# EAGLE design display3 (EAGLE 5.00)
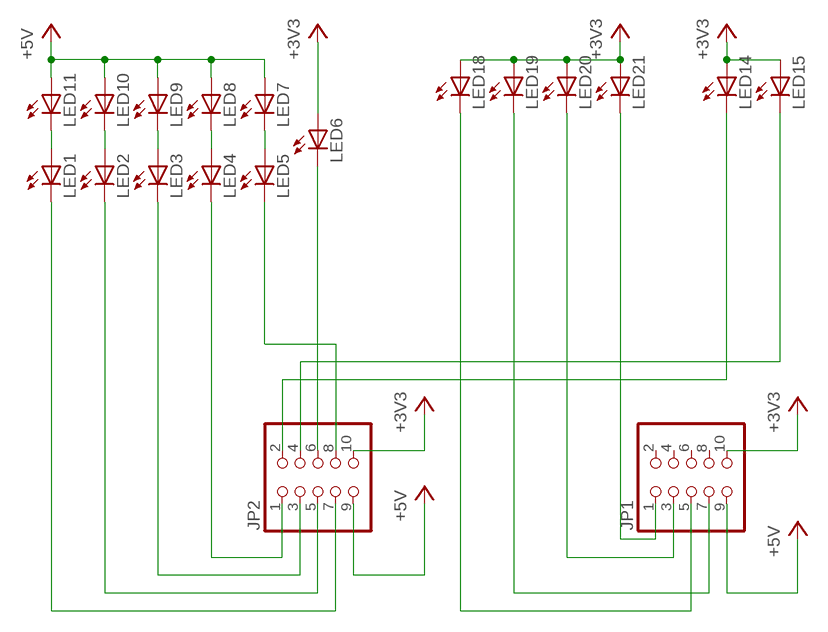
[diagram p0: schematic, sheet 1]

## Parts
JP1  PINHD-2X5  [2X05]
JP2  PINHD-2X5  [2X05]
LED1  LED5MM  [LED5MM]
LED2  LED5MM  [LED5MM]
LED3  LED5MM  [LED5MM]
LED4  LED5MM  [LED5MM]
LED5  LED5MM  [LED5MM]
LED6  LED5MM  [LED5MM]
LED7  LED5MM  [LED5MM]
LED8  LED5MM  [LED5MM]
LED9  LED5MM  [LED5MM]
LED10  LED5MM  [LED5MM]
LED11  LED5MM  [LED5MM]
LED14  LED5MM  [LED5MM]
LED15  LED5MM  [LED5MM]
LED18  LED5MM  [LED5MM]
LED19  LED5MM  [LED5MM]
LED20  LED5MM  [LED5MM]
LED21  LED5MM  [LED5MM]

## Nets
+3V3: JP1.10 JP2.10 LED6.A LED14.A LED15.A LED18.A LED19.A LED20.A LED21.A
+5V: JP1.9 JP2.9 LED7.A LED8.A LED9.A LED10.A LED11.A
N$1: JP2.7 LED1.K(C)
N$2: JP2.5 LED2.K(C)
N$3: JP2.3 LED3.K(C)
N$4: JP2.1 LED4.K(C)
N$5: JP2.8 LED5.K(C)
N$6: JP2.6 LED6.K(C)
N$7: JP1.5 LED18.K(C)
N$8: JP1.7 LED19.K(C)
N$9: JP1.3 LED20.K(C)
N$10: JP2.2 LED14.K(C)
N$14: JP1.1 LED21.K(C)
N$16: LED1.A LED11.K(C)
N$17: LED2.A LED10.K(C)
N$18: LED3.A LED9.K(C)
N$19: LED4.A LED8.K(C)
N$20: LED5.A LED7.K(C)
N$25: JP2.4 LED15.K(C)
Unconnected: JP1.2 JP1.4 JP1.6 JP1.8

## Library data of the parts
JP1 JP2 = pinhead:PINHD-2X5: PIN HEADER
LED1-LED11 LED14 LED15 LED18-LED21 = led:LED: LED OSRAM: - CHIPLED LG R971, LG N971, LY N971, LG Q971, LY Q971, LO R971, LY R971 LH N974, LH R974 LS Q976, LO Q976, LY Q976 LO Q996 - Hyper CHIPLED LW Q18S LB Q993, LB Q99A, LB R99A - SideLED LS A670, LO A670, LY A670, LG A670, LP A670 LB A673, LV A673, LT A673, LW A673 LH A674 LY A675 LS A676, LA A676, LO A676, LY A676, LW A676 LS A679, LY A679, LG A679 - Hyper Micro SIDELED® LS Y876, LA Y876, LO Y876, LY Y876 LT Y87S - SmartLED LW L88C, LW L88S LB L89C, LB L89S, LG L890 LS L89K, LO L89K, LY L89K LS L896, LA L896, LO L896, LY L896 - TOPLED LS T670, LO T670, LY T670, LG T670, LP T670 LSG T670, LSP T670, LSY T670, LOP T670, LYG T670 LG T671, LOG T671, LSG T671 LB T673, LV T673, LT T673, LW T673 LH T674 LS T676, LA T676, LO T676, LY T676, LB T676, LH T676, LSB T676, LW T676 LB T67C, LV T67C, LT T67C, LS T67K, LO T67K, LY T67K, LW E67C LS E67B, LA E67B, LO E67B, LY E67B, LB E67C, LV E67C, LT E67C LW T67C LS T679, LY T679, LG T679 LS T770, LO T770, LY T770, LG T770, LP T770 LB T773, LV T773, LT T773, LW T773 LH T774 LS E675, LA E675, LY E675, LS T675 LS T776, LA T776, LO T776, LY T776, LB T776 LHGB T686 LT T68C, LB T68C - Hyper Mini TOPLED® LB M676 - Mini TOPLED Santana® LG M470 LS M47K, LO M47K, LY M47K Source: http://www.osram.convergy.de - LUMILED® LXK2-PW12-R00, LXK2-PW12-S00, LXK2-PW14-U00, LXK2-PW14-V00 LXK2-PM12-R00, LXK2-PM12-S00, LXK2-PM14-U00 LXK2-PE12-Q00, LXK2-PE12-R00, LXK2-PE12-S00, LXK2-PE14-T00, LXK2-PE14-U00 LXK2-PB12-K00, LXK2-PB12-L00, LXK2-PB12-M00, LXK2-PB14-N00, LXK2-PB14-P00, LXK2-PB14-Q00 LXK2-PR12-L00, LXK2-PR12-M00, LXK2-PR14-Q00, LXK2-PR14-R00 LXK2-PD12-Q00, LXK2-PD12-R00, LXK2-PD12-S00 LXK2-PH12-R00, LXK2-PH12-S00 LXK2-PL12-P00, LXK2-PL12-Q00, LXK2-PL12-R00 Source: www.luxeon.com

## Board
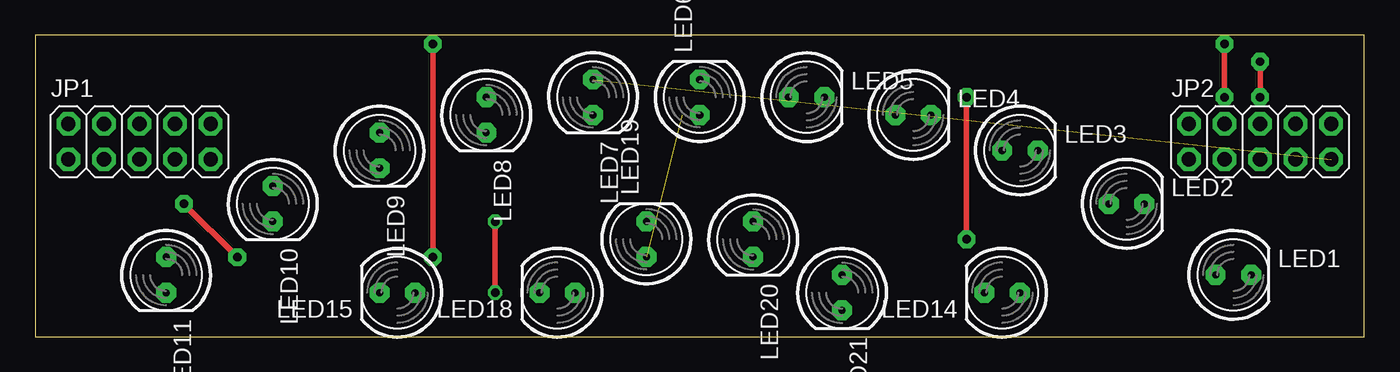
[diagram p1: board, top side]
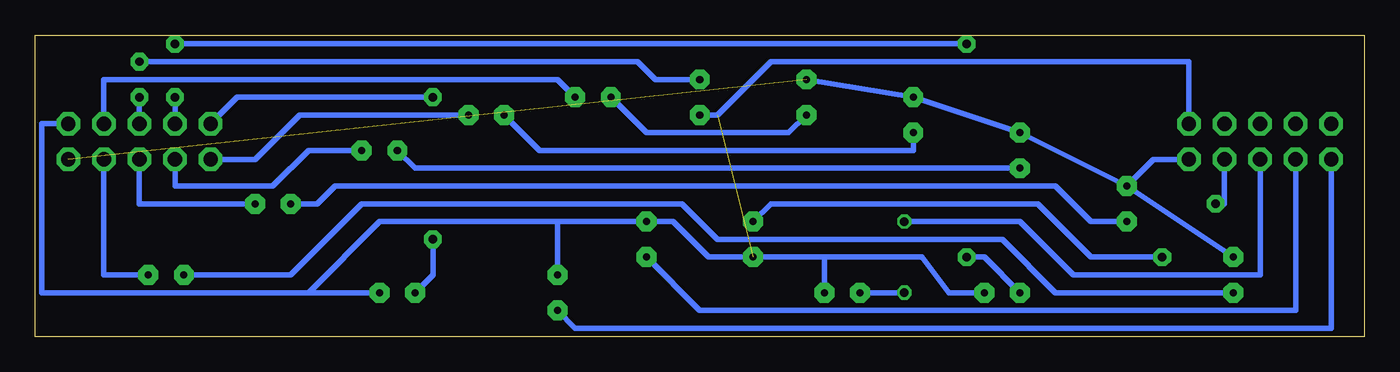
[diagram p2: board, bottom side, seen from below]

Size 94.92 x 21.58 mm. Coordinates in mm from the lower left corner, seen from the top.
Outline: 0,0 94.92,0 94.92,21.58 0,21.58 0,0
Copper layers (1*16): Top 0.035mm / dielectric 1.5mm / Bottom 0.035mm
Design rules "default": minimum track width 10mil, minimum drill 24mil, track to track 8mil, track to pad 8mil, pad to pad 8mil, via to via 8mil, smd to smd 8mil, copper to edge 40mil, drill to drill 8mil, minimum pad ring 10mil, minimum via ring 8mil, stop-mask expansion 4mil, vias tented up to drill 0mil, thermal gap 10mil

### Footprints (pad centres in the part's own frame; a part is rotated, then mirrored left to right if it is on the bottom)
2X05 = drill 1.016 pad 1.676 octagon: 1 -5.08,-1.27; 2 -5.08,1.27; 3 -2.54,-1.27; 4 -2.54,1.27; 5 0,-1.27; 6 0,1.27; 7 2.54,-1.27; 8 2.54,1.27; 9 5.08,-1.27; 10 5.08,1.27
LED5MM = drill 0.5 pad 1.422 octagon: A -1.27,0; K 1.27,0

### Placement (x,y rotation side)
JP1  7.46,13.96 0 top
JP2  87.47,13.96 0 top
LED1  85.56,4.44 0 top
LED2  77.94,9.52 0 top
LED3  70.32,13.33 0 top
LED4  62.7,15.87 0 top
LED5  55.08,17.14 0 top
LED6  47.46,17.14 90 top
LED7  39.84,17.14 270 top
LED8  32.22,15.87 270 top
LED9  24.6,13.33 270 top
LED10  16.98,9.52 270 top
LED11  9.36,4.44 270 top
LED14  69.05,3.17 180 top
LED15  25.87,3.17 180 top
LED18  37.3,3.17 180 top
LED19  43.65,6.98 90 top
LED20  51.27,6.98 270 top
LED21  57.62,3.17 270 top

### Tracks (layer width: path | path; a pad name or v marks a point on that pad's centre or on a via)
+3V3  (1 unrouted)
  Bottom 0.406: 38.57,5.71 LED19.A 46.83,5.71 49.37,8.25 LED20.A 57.62,8.25 | 57.62,8.25 LED21.A | 57.62,8.25 70.32,8.25 75.4,3.17 LED14.A 94.45,3.17 94.45,15.24 JP2.10 | JP1.10 12.54,19.68 42.38,19.68 46.19,15.87 LED6.A | LED15.A 29.68,3.17 31.59,5.71 38.57,5.71 | 38.57,5.71 LED18.A
+5V  (1 unrouted)
  Bottom 0.406: LED11.A LED10.A | LED10.A LED9.A LED8.A LED7.A | JP1.9 15.07,12.7 LED10.A
N$1
  Bottom 0.406: LED1.K 90.01,4.44 JP2.7
N$2
  Bottom 0.406: LED2.K 87.47,9.52 JP2.5
N$3
  Bottom 0.406: LED3.K 75.4,13.33 77.94,10.79 84.93,10.79 JP2.3
N$4
  Bottom 0.406: LED4.K 76.04,15.87 79.21,12.7 JP2.1
N$5
  Bottom 0.406: LED5.K 57.62,18.41 90.01,18.41 JP2.8
N$6  (via drill 0.6 pad 1.27)
  Top 0.406: v87.47,19.68 v87.47,17.14
  Bottom 0.406: LED6.K 50.63,18.41 51.91,19.68 v87.47,19.68 | v87.47,17.14 JP2.6
N$7  (via drill 0.6)
  Top 0.406: v32.85,3.17 v32.85,8.25
  Bottom 0.406: JP1.5 7.46,4.44 20.79,4.44 24.6,8.25 v32.85,8.25 | LED18.K v32.85,3.17
N$8  (via drill 0.6 pad 1.27)
  Top 0.406: v10.63,9.52 v14.44,5.71
  Bottom 0.406: LED19.K 42.38,9.52 23.33,9.52 19.52,5.71 v14.44,5.71 | JP1.7 9.99,9.52 v10.63,9.52
N$9
  Bottom 0.406: JP1.3 4.92,1.9 47.46,1.9 LED20.K
N$10  (via drill 0.6 pad 1.27)
  Top 0.406: v66.51,6.98 v66.51,17.14
  Bottom 0.406: LED14.K 66.51,4.44 v66.51,6.98 | v66.51,17.14 80.48,17.14 JP2.2
N$14
  Bottom 0.406: JP1.1 2.38,0.63 56.35,0.63 LED21.K
N$16
  Bottom 0.406: LED11.K 22.06,3.17 25.87,6.98 46.19,6.98 48.73,9.52 71.59,9.52 76.67,4.44 LED1.A
N$17
  Bottom 0.406: LED10.K 19.52,8.25 22.06,10.79 73.5,10.79 74.77,9.52 LED2.A
N$18
  Bottom 0.406: LED9.K 67.78,12.06 LED3.A
N$19
  Bottom 0.406: LED8.K 32.22,13.33 58.89,13.33 LED4.A
N$20
  Bottom 0.406: LED7.K 41.11,14.6 51.27,14.6 LED5.A
N$25  (via drill 0.6 pad 1.27)
  Top 0.406: v84.93,20.95 v84.93,17.14 | v28.41,5.71 v28.41,20.95
  Bottom 0.406: v84.93,17.14 JP2.4 | v28.41,20.95 v84.93,20.95 | v28.41,5.71 27.14,5.71 LED15.K